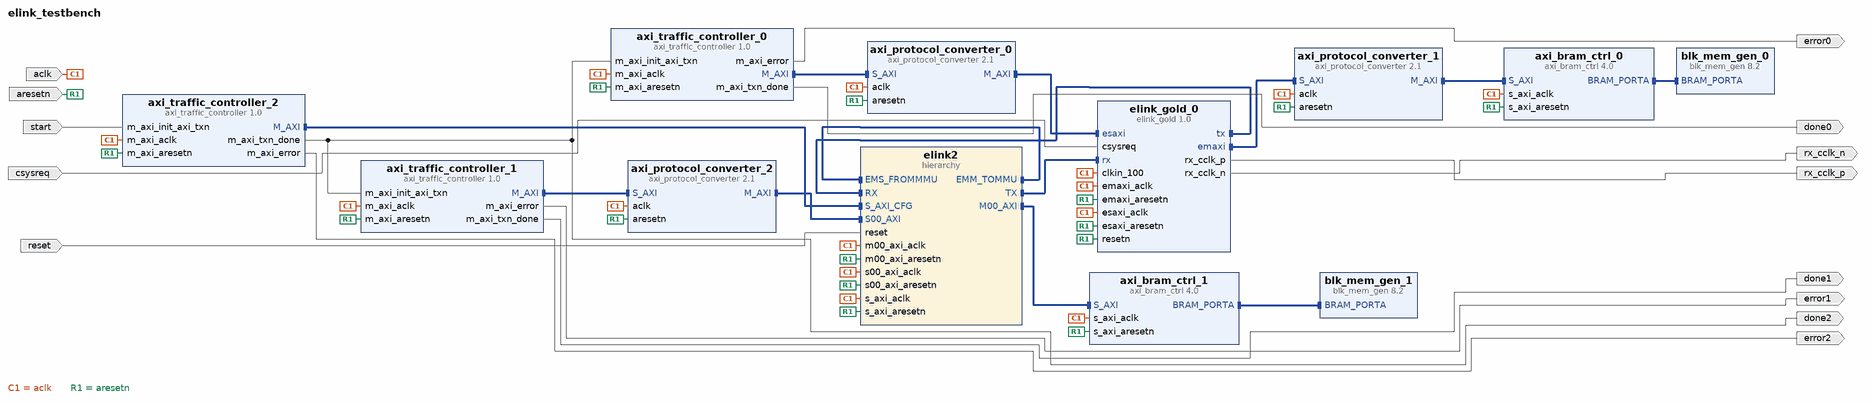
[diagram p0: block diagram of the top level]
# Vivado block design elink_testbench, Vivado 2014.3
create_bd_design elink_testbench

create_bd_port -dir I -type clk aclk
set_property -dict {CONFIG.FREQ_HZ 100000000 CONFIG.ASSOCIATED_RESET aresetn} [get_bd_ports aclk]
create_bd_port -dir I csysreq
create_bd_port -dir I -type rst aresetn
create_bd_port -dir O error0
create_bd_port -dir O error1
create_bd_port -dir O done1
create_bd_port -dir O done0
create_bd_port -dir I -type rst reset
set_property -dict {CONFIG.POLARITY ACTIVE_HIGH} [get_bd_ports reset]
create_bd_port -dir O done2
create_bd_port -dir I start
create_bd_port -dir O error2
create_bd_port -dir O rx_cclk_p
create_bd_port -dir O rx_cclk_n

create_bd_cell -type hier elink2
create_bd_cell -type ip -vlnv xilinx.com:ip:axi_bram_ctrl:4.0 axi_bram_ctrl_0
set_property -dict {CONFIG.DATA_WIDTH 64 CONFIG.PROTOCOL AXI4 CONFIG.SINGLE_PORT_BRAM 1} [get_bd_cells axi_bram_ctrl_0]
create_bd_cell -type ip -vlnv xilinx.com:ip:axi_bram_ctrl:4.0 axi_bram_ctrl_1
set_property -dict {CONFIG.DATA_WIDTH 64 CONFIG.PROTOCOL AXI4 CONFIG.SINGLE_PORT_BRAM 1} [get_bd_cells axi_bram_ctrl_1]
create_bd_cell -type ip -vlnv xilinx.com:ip:axi_protocol_converter:2.1 axi_protocol_converter_0
set_property -dict {CONFIG.SI_PROTOCOL AXI4LITE CONFIG.MI_PROTOCOL AXI3} [get_bd_cells axi_protocol_converter_0]
create_bd_cell -type ip -vlnv xilinx.com:ip:axi_protocol_converter:2.1 axi_protocol_converter_1
set_property -dict {CONFIG.SI_PROTOCOL AXI3 CONFIG.MI_PROTOCOL AXI4} [get_bd_cells axi_protocol_converter_1]
create_bd_cell -type ip -vlnv xilinx.com:ip:axi_protocol_converter:2.1 axi_protocol_converter_2
set_property -dict {CONFIG.SI_PROTOCOL AXI4LITE CONFIG.MI_PROTOCOL AXI4} [get_bd_cells axi_protocol_converter_2]
create_bd_cell -type ip -vlnv adapteva:user:axi_traffic_controller:1.0 axi_traffic_controller_0
set_property -dict [list \
  CONFIG.C_M_AXI_TRANSACTIONS_NUM 5 \
  CONFIG.write_data_file ../../wdata \
  CONFIG.write_addr_file ../../waddr \
  CONFIG.read_data_file ../../rdata0_out \
  CONFIG.read_addr_file ../../raddr \
] [get_bd_cells axi_traffic_controller_0]
create_bd_cell -type ip -vlnv adapteva:user:axi_traffic_controller:1.0 axi_traffic_controller_1
set_property -dict [list \
  CONFIG.C_M_AXI_TRANSACTIONS_NUM 5 \
  CONFIG.write_data_file ../../wdata \
  CONFIG.write_addr_file ../../waddr \
  CONFIG.read_data_file ../../rdata1_out \
  CONFIG.read_addr_file ../../raddr \
] [get_bd_cells axi_traffic_controller_1]
create_bd_cell -type ip -vlnv adapteva:user:axi_traffic_controller:1.0 axi_traffic_controller_2
set_property -dict [list \
  CONFIG.C_M_AXI_TRANSACTIONS_NUM 8 \
  CONFIG.write_data_file ../../wdata_ecfg \
  CONFIG.write_addr_file ../../waddr_ecfg \
  CONFIG.read_data_file ../../rdata1_ecfg_out \
  CONFIG.read_addr_file ../../raddr_ecfg \
] [get_bd_cells axi_traffic_controller_2]
create_bd_cell -type ip -vlnv xilinx.com:ip:blk_mem_gen:8.2 blk_mem_gen_0
set_property -dict [list \
  CONFIG.Enable_32bit_Address false \
  CONFIG.Use_Byte_Write_Enable true \
  CONFIG.Byte_Size 8 \
  CONFIG.Write_Width_A 64 \
  CONFIG.Write_Depth_A 1024 \
  CONFIG.Read_Width_A 64 \
  CONFIG.Enable_A Use_ENA_Pin \
  CONFIG.Register_PortA_Output_of_Memory_Primitives false \
  CONFIG.Fill_Remaining_Memory_Locations true \
  CONFIG.Remaining_Memory_Locations DEADBEEF \
  CONFIG.Use_RSTA_Pin false \
  CONFIG.use_bram_block Stand_Alone \
] [get_bd_cells blk_mem_gen_0]
create_bd_cell -type ip -vlnv xilinx.com:ip:blk_mem_gen:8.2 blk_mem_gen_1
set_property -dict [list \
  CONFIG.Enable_32bit_Address false \
  CONFIG.Use_Byte_Write_Enable true \
  CONFIG.Byte_Size 8 \
  CONFIG.Write_Width_A 64 \
  CONFIG.Write_Depth_A 1024 \
  CONFIG.Read_Width_A 64 \
  CONFIG.Enable_A Use_ENA_Pin \
  CONFIG.Register_PortA_Output_of_Memory_Primitives false \
  CONFIG.Fill_Remaining_Memory_Locations true \
  CONFIG.Remaining_Memory_Locations DEADBEEF \
  CONFIG.Use_RSTA_Pin false \
  CONFIG.use_bram_block Stand_Alone \
] [get_bd_cells blk_mem_gen_1]
create_bd_cell -type ip -vlnv adapteva.com:Adapteva:elink_gold:1.0 elink_gold_0
set_property -dict {CONFIG.SAW 32} [get_bd_cells elink_gold_0]

# ---- hierarchy /elink2 ----
current_bd_instance /elink2
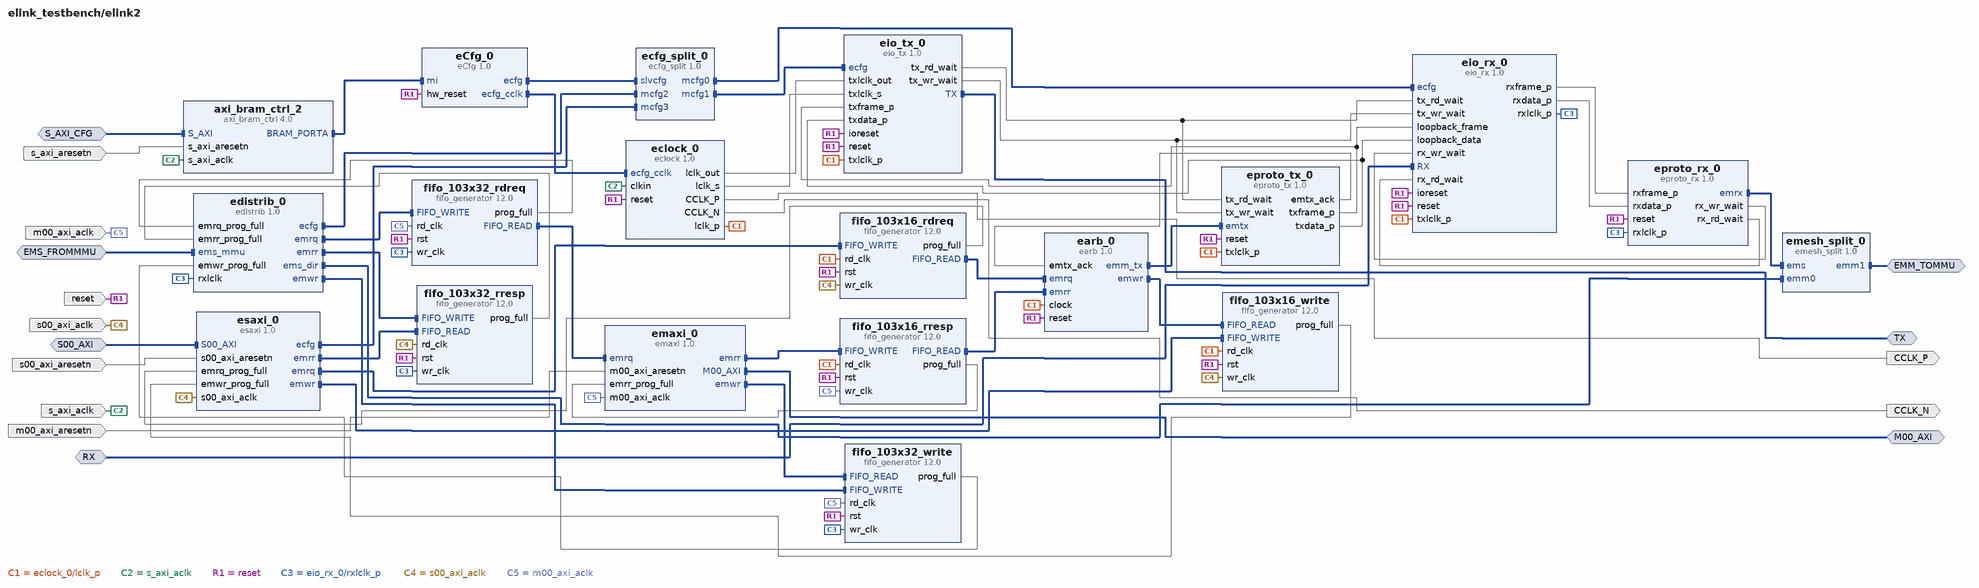
[diagram p1: block diagram inside /elink2]
create_bd_intf_pin -mode Slave -vlnv xilinx.com:interface:aximm_rtl:1.0 S_AXI_CFG
create_bd_intf_pin -mode Slave -vlnv adapteva.com:interface:eLink_rtl:1.0 RX
create_bd_intf_pin -mode Master -vlnv adapteva.com:interface:eLink_rtl:1.0 TX
create_bd_intf_pin -mode Master -vlnv adapteva.com:Adapteva:eMesh_rtl:1.0 EMM_TOMMU
create_bd_intf_pin -mode Slave -vlnv adapteva.com:Adapteva:eMesh_rtl:1.0 EMS_FROMMMU
create_bd_intf_pin -mode Slave -vlnv xilinx.com:interface:aximm_rtl:1.0 S00_AXI
create_bd_intf_pin -mode Master -vlnv xilinx.com:interface:aximm_rtl:1.0 M00_AXI
create_bd_pin -dir I -type clk s_axi_aclk
create_bd_pin -dir I -type rst reset
create_bd_pin -dir I -type rst s_axi_aresetn
create_bd_pin -dir O CCLK_P
create_bd_pin -dir O CCLK_N
create_bd_pin -dir I -type clk s00_axi_aclk
create_bd_pin -dir I -type rst s00_axi_aresetn
create_bd_pin -dir I -type clk m00_axi_aclk
create_bd_pin -dir I -type rst m00_axi_aresetn

create_bd_cell -type ip -vlnv xilinx.com:ip:axi_bram_ctrl:4.0 axi_bram_ctrl_2
set_property -dict {CONFIG.PROTOCOL AXI4LITE CONFIG.SINGLE_PORT_BRAM 1} [get_bd_cells axi_bram_ctrl_2]
create_bd_cell -type ip -vlnv adapteva.com:Adapteva:eCfg:1.0 eCfg_0
set_property -dict {CONFIG.E_VERSION 0x01030303} [get_bd_cells eCfg_0]
create_bd_cell -type ip -vlnv adapteva.com:Adapteva:earb:1.0 earb_0
create_bd_cell -type ip -vlnv adapteva.com:Adapteva:ecfg_split:1.0 ecfg_split_0
create_bd_cell -type ip -vlnv adapteva.com:Adapteva:eclock:1.0 eclock_0
create_bd_cell -type ip -vlnv adapteva.com:Adapteva:edistrib:1.0 edistrib_0
set_property -dict {CONFIG.C_READ_TAG_ADDR 0x810} [get_bd_cells edistrib_0]
create_bd_cell -type ip -vlnv adapteva.com:Adapteva:eio_rx:1.0 eio_rx_0
create_bd_cell -type ip -vlnv adapteva.com:Adapteva:emaxi:1.0 emaxi_0
create_bd_cell -type ip -vlnv adapteva.com:Adapteva:emesh_split:1.0 emesh_split_0
create_bd_cell -type ip -vlnv adapteva.com:Adapteva:eproto_rx:1.0 eproto_rx_0
create_bd_cell -type ip -vlnv adapteva.com:Adatpeva:eproto_tx:1.0 eproto_tx_0
create_bd_cell -type ip -vlnv adapteva.com:Adapteva:esaxi:1.0 esaxi_0
create_bd_cell -type ip -vlnv xilinx.com:ip:fifo_generator:12.0 fifo_103x16_write
set_property -dict [list \
  CONFIG.Fifo_Implementation Independent_Clocks_Distributed_RAM \
  CONFIG.Performance_Options First_Word_Fall_Through \
  CONFIG.Input_Data_Width 103 \
  CONFIG.Input_Depth 16 \
  CONFIG.Use_Dout_Reset true \
  CONFIG.Programmable_Full_Type Single_Programmable_Full_Threshold_Constant \
  CONFIG.Full_Threshold_Assert_Value 12 \
] [get_bd_cells fifo_103x16_write]
create_bd_cell -type ip -vlnv xilinx.com:ip:fifo_generator:12.0 fifo_103x16_rdreq
set_property -dict [list \
  CONFIG.Fifo_Implementation Independent_Clocks_Distributed_RAM \
  CONFIG.Performance_Options First_Word_Fall_Through \
  CONFIG.Input_Data_Width 103 \
  CONFIG.Input_Depth 16 \
  CONFIG.Use_Dout_Reset true \
  CONFIG.Programmable_Full_Type Single_Programmable_Full_Threshold_Constant \
  CONFIG.Full_Threshold_Assert_Value 12 \
] [get_bd_cells fifo_103x16_rdreq]
create_bd_cell -type ip -vlnv xilinx.com:ip:fifo_generator:12.0 fifo_103x16_rresp
set_property -dict [list \
  CONFIG.Fifo_Implementation Independent_Clocks_Distributed_RAM \
  CONFIG.Performance_Options First_Word_Fall_Through \
  CONFIG.Input_Data_Width 103 \
  CONFIG.Input_Depth 16 \
  CONFIG.Use_Dout_Reset true \
  CONFIG.Programmable_Full_Type Single_Programmable_Full_Threshold_Constant \
  CONFIG.Full_Threshold_Assert_Value 12 \
] [get_bd_cells fifo_103x16_rresp]
create_bd_cell -type ip -vlnv xilinx.com:ip:fifo_generator:12.0 fifo_103x32_rresp
set_property -dict [list \
  CONFIG.Fifo_Implementation Independent_Clocks_Distributed_RAM \
  CONFIG.Performance_Options First_Word_Fall_Through \
  CONFIG.Input_Data_Width 103 \
  CONFIG.Input_Depth 32 \
  CONFIG.Use_Dout_Reset false \
  CONFIG.Programmable_Full_Type Single_Programmable_Full_Threshold_Constant \
  CONFIG.Full_Threshold_Assert_Value 16 \
] [get_bd_cells fifo_103x32_rresp]
create_bd_cell -type ip -vlnv xilinx.com:ip:fifo_generator:12.0 fifo_103x32_rdreq
set_property -dict [list \
  CONFIG.Fifo_Implementation Independent_Clocks_Distributed_RAM \
  CONFIG.Performance_Options First_Word_Fall_Through \
  CONFIG.Input_Data_Width 103 \
  CONFIG.Input_Depth 32 \
  CONFIG.Use_Dout_Reset false \
  CONFIG.Programmable_Full_Type Single_Programmable_Full_Threshold_Constant \
  CONFIG.Full_Threshold_Assert_Value 16 \
] [get_bd_cells fifo_103x32_rdreq]
create_bd_cell -type ip -vlnv xilinx.com:ip:fifo_generator:12.0 fifo_103x32_write
set_property -dict [list \
  CONFIG.Fifo_Implementation Independent_Clocks_Distributed_RAM \
  CONFIG.Performance_Options First_Word_Fall_Through \
  CONFIG.Input_Data_Width 103 \
  CONFIG.Input_Depth 32 \
  CONFIG.Use_Dout_Reset false \
  CONFIG.Programmable_Full_Type Single_Programmable_Full_Threshold_Constant \
  CONFIG.Full_Threshold_Assert_Value 16 \
] [get_bd_cells fifo_103x32_write]
create_bd_cell -type ip -vlnv adapteva.com:Adapteva:eio_tx:1.0 eio_tx_0

# ---- connections ----

current_bd_instance /elink2
connect_bd_intf_net [get_bd_intf_pins ecfg_split_0/mcfg0] [get_bd_intf_pins eio_rx_0/ecfg]
connect_bd_intf_net [get_bd_intf_pins ecfg_split_0/mcfg1] [get_bd_intf_pins eio_tx_0/ecfg]
connect_bd_intf_net [get_bd_intf_pins axi_bram_ctrl_2/BRAM_PORTA] [get_bd_intf_pins eCfg_0/mi]
connect_bd_intf_net [get_bd_intf_pins eCfg_0/ecfg_cclk] [get_bd_intf_pins eclock_0/ecfg_cclk]
connect_bd_intf_net [get_bd_intf_pins eCfg_0/ecfg] [get_bd_intf_pins ecfg_split_0/slvcfg]
connect_bd_intf_net [get_bd_intf_pins earb_0/emm_tx] [get_bd_intf_pins eproto_tx_0/emtx]
connect_bd_intf_net [get_bd_intf_pins earb_0/emwr] [get_bd_intf_pins fifo_103x16_write/FIFO_READ]
connect_bd_intf_net [get_bd_intf_pins fifo_103x16_rdreq/FIFO_READ] [get_bd_intf_pins earb_0/emrq]
connect_bd_intf_net [get_bd_intf_pins eproto_rx_0/emrx] [get_bd_intf_pins emesh_split_0/ems]
connect_bd_intf_net [get_bd_intf_pins edistrib_0/ecfg] [get_bd_intf_pins ecfg_split_0/mcfg2]
connect_bd_intf_net [get_bd_intf_pins edistrib_0/ems_dir] [get_bd_intf_pins emesh_split_0/emm0]
connect_bd_intf_net [get_bd_intf_pins edistrib_0/emwr] [get_bd_intf_pins fifo_103x32_write/FIFO_WRITE]
connect_bd_intf_net [get_bd_intf_pins edistrib_0/emrr] [get_bd_intf_pins fifo_103x32_rresp/FIFO_WRITE]
connect_bd_intf_net [get_bd_intf_pins edistrib_0/emrq] [get_bd_intf_pins fifo_103x32_rdreq/FIFO_WRITE]
connect_bd_intf_net [get_bd_intf_pins fifo_103x16_rresp/FIFO_READ] [get_bd_intf_pins earb_0/emrr]
connect_bd_intf_net [get_bd_intf_pins esaxi_0/ecfg] [get_bd_intf_pins ecfg_split_0/mcfg3]
connect_bd_intf_net [get_bd_intf_pins esaxi_0/emrq] [get_bd_intf_pins fifo_103x16_rdreq/FIFO_WRITE]
connect_bd_intf_net [get_bd_intf_pins esaxi_0/emwr] [get_bd_intf_pins fifo_103x16_write/FIFO_WRITE]
connect_bd_intf_net [get_bd_intf_pins esaxi_0/emrr] [get_bd_intf_pins fifo_103x32_rresp/FIFO_READ]
connect_bd_intf_net [get_bd_intf_pins fifo_103x32_rdreq/FIFO_READ] [get_bd_intf_pins emaxi_0/emrq]
connect_bd_intf_net [get_bd_intf_pins emaxi_0/emwr] [get_bd_intf_pins fifo_103x32_write/FIFO_READ]
connect_bd_intf_net [get_bd_intf_pins emaxi_0/emrr] [get_bd_intf_pins fifo_103x16_rresp/FIFO_WRITE]
connect_bd_intf_net -intf_net S_AXI_REGS_1 [get_bd_intf_pins S_AXI_CFG] [get_bd_intf_pins axi_bram_ctrl_2/S_AXI]
connect_bd_intf_net [get_bd_intf_pins RX] [get_bd_intf_pins eio_rx_0/RX]
connect_bd_intf_net [get_bd_intf_pins TX] [get_bd_intf_pins eio_tx_0/TX]
connect_bd_intf_net [get_bd_intf_pins EMM_TOMMU] [get_bd_intf_pins emesh_split_0/emm1]
connect_bd_intf_net [get_bd_intf_pins EMS_FROMMMU] [get_bd_intf_pins edistrib_0/ems_mmu]
connect_bd_intf_net [get_bd_intf_pins S00_AXI] [get_bd_intf_pins esaxi_0/S00_AXI]
connect_bd_intf_net [get_bd_intf_pins M00_AXI] [get_bd_intf_pins emaxi_0/M00_AXI]
connect_bd_net [get_bd_pins eclock_0/lclk_p] \
  [get_bd_pins earb_0/clock] [get_bd_pins eio_rx_0/txlclk_p] [get_bd_pins eproto_tx_0/txlclk_p] \
  [get_bd_pins fifo_103x16_write/rd_clk] [get_bd_pins fifo_103x16_rdreq/rd_clk] [get_bd_pins fifo_103x16_rresp/rd_clk] \
  [get_bd_pins eio_tx_0/txlclk_p]
connect_bd_net [get_bd_pins s_axi_aclk] [get_bd_pins axi_bram_ctrl_2/s_axi_aclk] [get_bd_pins eclock_0/clkin]
connect_bd_net [get_bd_pins reset] \
  [get_bd_pins eCfg_0/hw_reset] [get_bd_pins earb_0/reset] [get_bd_pins eclock_0/reset] [get_bd_pins eio_rx_0/reset] \
  [get_bd_pins eio_rx_0/ioreset] [get_bd_pins eproto_rx_0/reset] [get_bd_pins eproto_tx_0/reset] \
  [get_bd_pins fifo_103x16_write/rst] [get_bd_pins fifo_103x16_rdreq/rst] [get_bd_pins fifo_103x16_rresp/rst] \
  [get_bd_pins fifo_103x32_rresp/rst] [get_bd_pins fifo_103x32_rdreq/rst] [get_bd_pins fifo_103x32_write/rst] \
  [get_bd_pins eio_tx_0/reset] [get_bd_pins eio_tx_0/ioreset]
connect_bd_net -net aresetn_1 [get_bd_pins s_axi_aresetn] [get_bd_pins axi_bram_ctrl_2/s_axi_aresetn]
connect_bd_net [get_bd_pins eio_tx_0/tx_rd_wait] [get_bd_pins eio_rx_0/tx_rd_wait] [get_bd_pins eproto_tx_0/tx_rd_wait]
connect_bd_net [get_bd_pins eio_tx_0/tx_wr_wait] [get_bd_pins eio_rx_0/tx_wr_wait] [get_bd_pins eproto_tx_0/tx_wr_wait]
connect_bd_net [get_bd_pins eclock_0/lclk_out] [get_bd_pins eio_tx_0/txlclk_out]
connect_bd_net [get_bd_pins eclock_0/lclk_s] [get_bd_pins eio_tx_0/txlclk_s]
connect_bd_net [get_bd_pins eclock_0/CCLK_P] [get_bd_pins CCLK_P]
connect_bd_net [get_bd_pins eclock_0/CCLK_N] [get_bd_pins CCLK_N]
connect_bd_net [get_bd_pins eproto_tx_0/txframe_p] [get_bd_pins eio_rx_0/loopback_frame] [get_bd_pins eio_tx_0/txframe_p]
connect_bd_net [get_bd_pins eproto_tx_0/txdata_p] [get_bd_pins eio_rx_0/loopback_data] [get_bd_pins eio_tx_0/txdata_p]
connect_bd_net [get_bd_pins eio_rx_0/rxlclk_p] \
  [get_bd_pins edistrib_0/rxlclk] [get_bd_pins eproto_rx_0/rxlclk_p] [get_bd_pins fifo_103x32_rresp/wr_clk] \
  [get_bd_pins fifo_103x32_rdreq/wr_clk] [get_bd_pins fifo_103x32_write/wr_clk]
connect_bd_net [get_bd_pins eio_rx_0/rxframe_p] [get_bd_pins eproto_rx_0/rxframe_p]
connect_bd_net [get_bd_pins eio_rx_0/rxdata_p] [get_bd_pins eproto_rx_0/rxdata_p]
connect_bd_net -net fifo_103x32_0_prog_full [get_bd_pins fifo_103x32_write/prog_full] [get_bd_pins edistrib_0/emwr_prog_full]
connect_bd_net -net fifo_103x32_2_prog_full [get_bd_pins fifo_103x32_rdreq/prog_full] [get_bd_pins edistrib_0/emrq_prog_full]
connect_bd_net -net fifo_103x32_1_prog_full [get_bd_pins fifo_103x32_rresp/prog_full] [get_bd_pins edistrib_0/emrr_prog_full]
connect_bd_net [get_bd_pins s00_axi_aclk] \
  [get_bd_pins esaxi_0/s00_axi_aclk] [get_bd_pins fifo_103x16_write/wr_clk] [get_bd_pins fifo_103x16_rdreq/wr_clk] \
  [get_bd_pins fifo_103x32_rresp/rd_clk]
connect_bd_net [get_bd_pins m00_axi_aclk] \
  [get_bd_pins emaxi_0/m00_axi_aclk] [get_bd_pins fifo_103x16_rresp/wr_clk] [get_bd_pins fifo_103x32_rdreq/rd_clk] \
  [get_bd_pins fifo_103x32_write/rd_clk]
connect_bd_net [get_bd_pins eproto_rx_0/rx_wr_wait] [get_bd_pins eio_rx_0/rx_wr_wait]
connect_bd_net [get_bd_pins eproto_rx_0/rx_rd_wait] [get_bd_pins eio_rx_0/rx_rd_wait]
connect_bd_net [get_bd_pins s00_axi_aresetn] [get_bd_pins esaxi_0/s00_axi_aresetn]
connect_bd_net [get_bd_pins fifo_103x16_rdreq/prog_full] [get_bd_pins esaxi_0/emrq_prog_full]
connect_bd_net [get_bd_pins fifo_103x16_write/prog_full] [get_bd_pins esaxi_0/emwr_prog_full]
connect_bd_net [get_bd_pins eproto_tx_0/emtx_ack] [get_bd_pins earb_0/emtx_ack]
connect_bd_net [get_bd_pins fifo_103x16_rresp/prog_full] [get_bd_pins emaxi_0/emrr_prog_full]
connect_bd_net [get_bd_pins m00_axi_aresetn] [get_bd_pins emaxi_0/m00_axi_aresetn]

current_bd_instance /
connect_bd_intf_net [get_bd_intf_pins axi_traffic_controller_0/M_AXI] [get_bd_intf_pins axi_protocol_converter_0/S_AXI]
connect_bd_intf_net [get_bd_intf_pins axi_bram_ctrl_0/BRAM_PORTA] [get_bd_intf_pins blk_mem_gen_0/BRAM_PORTA]
connect_bd_intf_net [get_bd_intf_pins axi_protocol_converter_1/M_AXI] [get_bd_intf_pins axi_bram_ctrl_0/S_AXI]
connect_bd_intf_net [get_bd_intf_pins axi_protocol_converter_0/M_AXI] [get_bd_intf_pins elink_gold_0/esaxi]
connect_bd_intf_net [get_bd_intf_pins elink_gold_0/emaxi] [get_bd_intf_pins axi_protocol_converter_1/S_AXI]
connect_bd_intf_net -intf_net axi_bram_ctrl_0_BRAM_PORTA1 [get_bd_intf_pins axi_bram_ctrl_1/BRAM_PORTA] [get_bd_intf_pins blk_mem_gen_1/BRAM_PORTA]
connect_bd_intf_net -intf_net axi_traffic_controller_0_M_AXI1 [get_bd_intf_pins axi_traffic_controller_1/M_AXI] [get_bd_intf_pins axi_protocol_converter_2/S_AXI]
connect_bd_intf_net [get_bd_intf_pins elink_gold_0/tx] [get_bd_intf_pins elink2/RX]
connect_bd_intf_net [get_bd_intf_pins elink_gold_0/rx] [get_bd_intf_pins elink2/TX]
connect_bd_intf_net [get_bd_intf_pins axi_protocol_converter_2/M_AXI] [get_bd_intf_pins elink2/S00_AXI]
connect_bd_intf_net [get_bd_intf_pins axi_traffic_controller_2/M_AXI] [get_bd_intf_pins elink2/S_AXI_CFG]
connect_bd_intf_net [get_bd_intf_pins elink2/M00_AXI] [get_bd_intf_pins axi_bram_ctrl_1/S_AXI]
connect_bd_intf_net [get_bd_intf_pins elink2/EMM_TOMMU] [get_bd_intf_pins elink2/EMS_FROMMMU]
connect_bd_net [get_bd_ports aclk] \
  [get_bd_pins elink2/s_axi_aclk] [get_bd_pins elink2/m00_axi_aclk] [get_bd_pins elink2/s00_axi_aclk] \
  [get_bd_pins axi_bram_ctrl_0/s_axi_aclk] [get_bd_pins axi_bram_ctrl_1/s_axi_aclk] \
  [get_bd_pins axi_protocol_converter_0/aclk] [get_bd_pins axi_protocol_converter_1/aclk] \
  [get_bd_pins axi_protocol_converter_2/aclk] [get_bd_pins axi_traffic_controller_0/m_axi_aclk] \
  [get_bd_pins axi_traffic_controller_1/m_axi_aclk] [get_bd_pins axi_traffic_controller_2/m_axi_aclk] \
  [get_bd_pins elink_gold_0/clkin_100] [get_bd_pins elink_gold_0/esaxi_aclk] [get_bd_pins elink_gold_0/emaxi_aclk]
connect_bd_net [get_bd_ports csysreq] [get_bd_pins elink_gold_0/csysreq]
connect_bd_net -net rst_aclk_100M_peripheral_aresetn1 [get_bd_ports aresetn] \
  [get_bd_pins elink2/s_axi_aresetn] [get_bd_pins elink2/m00_axi_aresetn] [get_bd_pins elink2/s00_axi_aresetn] \
  [get_bd_pins axi_bram_ctrl_0/s_axi_aresetn] [get_bd_pins axi_bram_ctrl_1/s_axi_aresetn] \
  [get_bd_pins axi_protocol_converter_0/aresetn] [get_bd_pins axi_protocol_converter_1/aresetn] \
  [get_bd_pins axi_protocol_converter_2/aresetn] [get_bd_pins axi_traffic_controller_0/m_axi_aresetn] \
  [get_bd_pins axi_traffic_controller_1/m_axi_aresetn] [get_bd_pins axi_traffic_controller_2/m_axi_aresetn] \
  [get_bd_pins elink_gold_0/resetn] [get_bd_pins elink_gold_0/esaxi_aresetn] [get_bd_pins elink_gold_0/emaxi_aresetn]
connect_bd_net [get_bd_pins axi_traffic_controller_0/m_axi_error] [get_bd_ports error0]
connect_bd_net -net axi_traffic_controller_0_m_axi_error1 [get_bd_pins axi_traffic_controller_1/m_axi_error] [get_bd_ports error1]
connect_bd_net -net axi_traffic_controller_0_m_axi_txn_done1 [get_bd_pins axi_traffic_controller_1/m_axi_txn_done] [get_bd_ports done1]
connect_bd_net [get_bd_pins axi_traffic_controller_0/m_axi_txn_done] [get_bd_ports done0]
connect_bd_net [get_bd_ports reset] [get_bd_pins elink2/reset]
connect_bd_net [get_bd_pins axi_traffic_controller_2/m_axi_txn_done] \
  [get_bd_ports done2] [get_bd_pins axi_traffic_controller_0/m_axi_init_axi_txn] \
  [get_bd_pins axi_traffic_controller_1/m_axi_init_axi_txn]
connect_bd_net [get_bd_ports start] [get_bd_pins axi_traffic_controller_2/m_axi_init_axi_txn]
connect_bd_net [get_bd_pins axi_traffic_controller_2/m_axi_error] [get_bd_ports error2]
connect_bd_net [get_bd_pins elink_gold_0/rx_cclk_p] [get_bd_ports rx_cclk_p]
connect_bd_net [get_bd_pins elink_gold_0/rx_cclk_n] [get_bd_ports rx_cclk_n]

# ---- address map ----
assign_bd_address -offset 0x0 -range 4G -target_address_space [get_bd_addr_spaces axi_traffic_controller_0/M_AXI] [get_bd_addr_segs elink_gold_0/esaxi/reg0]
assign_bd_address -offset 0x76000000 -range 64K -target_address_space [get_bd_addr_spaces axi_traffic_controller_1/M_AXI] [get_bd_addr_segs elink2/esaxi_0/S00_AXI/S00_AXI_mem]
assign_bd_address -offset 0xC0000000 -range 8K -target_address_space [get_bd_addr_spaces axi_traffic_controller_2/M_AXI] [get_bd_addr_segs elink2/axi_bram_ctrl_2/S_AXI/Mem0]
assign_bd_address -offset 0xC0000000 -range 8K -target_address_space [get_bd_addr_spaces elink2/emaxi_0/M00_AXI] [get_bd_addr_segs axi_bram_ctrl_1/S_AXI/Mem0]
assign_bd_address -offset 0xC0000000 -range 8K -target_address_space [get_bd_addr_spaces elink_gold_0/emaxi] [get_bd_addr_segs axi_bram_ctrl_0/S_AXI/Mem0]

validate_bd_design
save_bd_design
